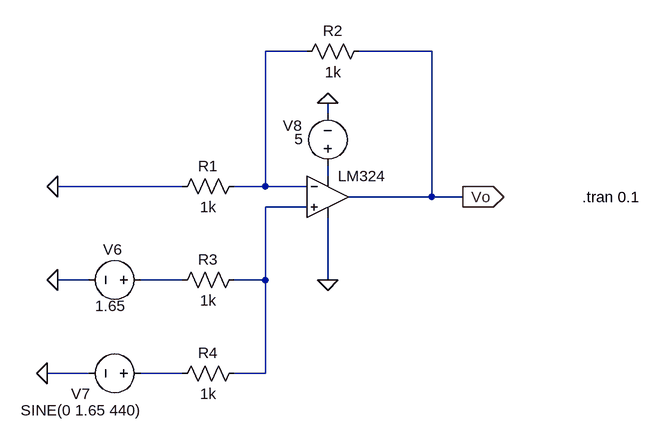
[diagram p0: schematic Signal conditioning ciruit.asc]
Signal conditioning ciruit.asc, the LTspice schematic file:
Version 4
SHEET 1 880 1080
WIRE 192 464 128 464
WIRE 384 464 272 464
WIRE 224 560 224 544
WIRE 224 656 224 640
WIRE 0 672 -192 672
WIRE 128 672 128 464
WIRE 128 672 80 672
WIRE 192 672 128 672
WIRE 384 688 384 464
WIRE 384 688 256 688
WIRE 432 688 384 688
WIRE 192 704 128 704
WIRE -144 816 -192 816
WIRE 0 816 -64 816
WIRE 128 816 128 704
WIRE 128 816 80 816
WIRE 224 816 224 720
WIRE -144 960 -208 960
WIRE 0 960 -64 960
WIRE 128 960 128 816
WIRE 128 960 80 960
FLAG 224 816 0
FLAG -192 816 0
FLAG 224 544 0
FLAG -192 672 0
FLAG 432 688 Vo
IOPIN 432 688 Out
FLAG -208 960 0
SYMBOL OpAmps\\UniversalOpamp2 224 688 R0
SYMATTR InstName LM324
SYMBOL voltage -48 816 R90
WINDOW 0 -47 45 VRight 2
WINDOW 3 40 39 VRight 2
WINDOW 123 0 0 Left 0
WINDOW 39 0 0 Left 0
SYMATTR InstName V6
SYMATTR Value 1.65
SYMBOL voltage 224 656 R180
WINDOW 0 40 78 Left 2
WINDOW 3 38 57 Left 2
WINDOW 123 0 0 Left 0
WINDOW 39 0 0 Left 0
SYMATTR InstName V8
SYMATTR Value 5
SYMBOL voltage -48 960 R90
WINDOW 0 31 94 VRight 2
WINDOW 3 57 14 VRight 2
WINDOW 123 0 0 Left 0
WINDOW 39 0 0 Left 0
SYMATTR InstName V7
SYMATTR Value SINE(0 1.65 440)
SYMBOL res 96 656 R90
WINDOW 0 0 56 VBottom 2
WINDOW 3 32 56 VTop 2
SYMATTR InstName R1
SYMATTR Value 1k
SYMBOL res 96 800 R90
WINDOW 0 0 56 VBottom 2
WINDOW 3 32 56 VTop 2
SYMATTR InstName R3
SYMATTR Value 1k
SYMBOL res 96 944 R90
WINDOW 0 0 56 VBottom 2
WINDOW 3 32 56 VTop 2
SYMATTR InstName R4
SYMATTR Value 1k
SYMBOL res 288 448 R90
WINDOW 0 0 56 VBottom 2
WINDOW 3 32 56 VTop 2
SYMATTR InstName R2
SYMATTR Value 1k
TEXT 616 688 Left 2 !.tran 0.1

The netlist it stands for:
* Signal conditioning ciruit.asc
XLM324 N003 N001 N002 0 Vo level.2 Avol=1Meg GBW=10Meg Slew=10Meg ilimit=25m rail=0 Vos=0 phimargin=45 en=0 enk=0 in=0 ink=0 Rin=500Meg  ; pins IN+ IN- V+ V- OUT
V6 N004 0 1.65
V8 N002 0 5
V7 N005 0 SINE(0 1.65 440)
R1 N001 0 1k
R3 N003 N004 1k
R4 N003 N005 1k
R2 Vo N001 1k
.tran 0.1
.lib UniversalOpamps2.sub
.backanno
.end